# Altium project 031810516xcc.PrjPcb
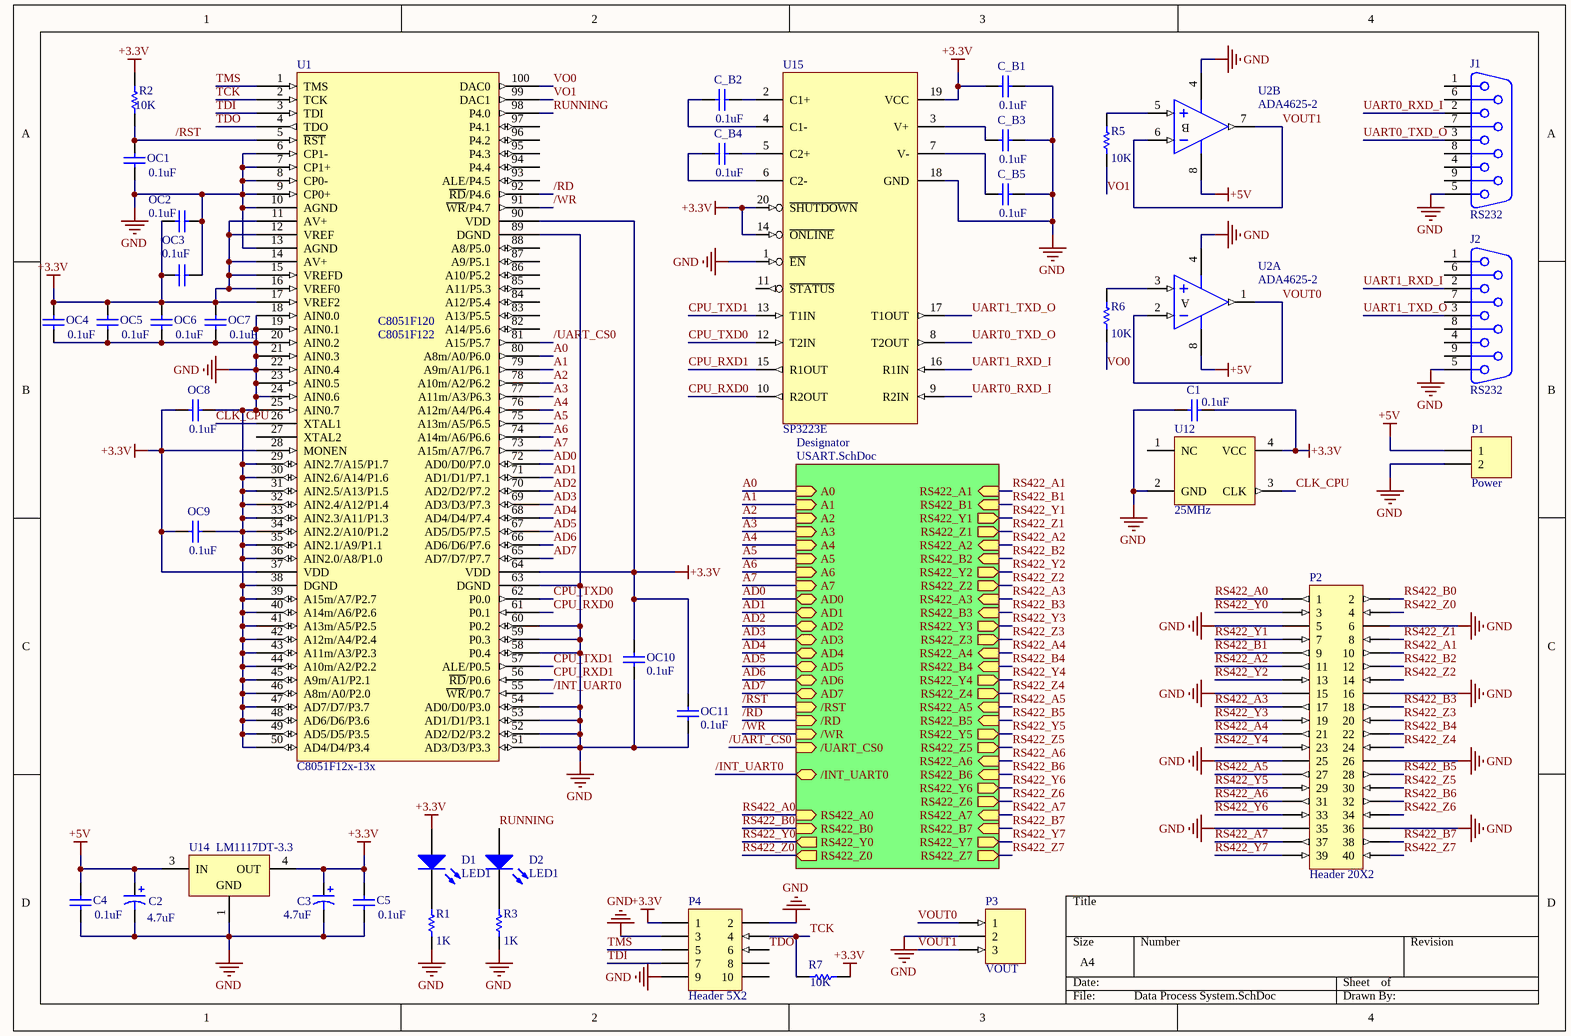
[diagram p0: Data Process System.SchDoc]
2 sheets, 65 parts. Net scope: hierarchical (ports join the sheet entries above them; power ports are global).
Board file: MyPCB.PcbDoc
Sheets:
  Data Process System.SchDoc
    Designator = USART.SchDoc

## Sheet Data Process System.SchDoc
size A4

### Parts
C1  value 0.1uF  [0805]  (hidden comment: Cap 0.1uf)
C2  value 4.7uF  [3528]  (hidden comment: Cap Pol 4.7uf)
C3  value 4.7uF  [3528]  (hidden comment: Cap Pol 4.7uf)
C4  value 0.1uF  [0805]  (hidden comment: Cap 0.1uf)
C5  value 0.1uF  [0805]  (hidden comment: Cap 0.1uf)
C_B1  value 0.1uF  [0805]  (hidden comment: Cap 0.1uf)
C_B2  value 0.1uF  [0805]  (hidden comment: Cap 0.1uf)
C_B3  value 0.1uF  [0805]  (hidden comment: Cap 0.1uf)
C_B4  value 0.1uF  [0805]  (hidden comment: Cap 0.1uf)
C_B5  value 0.1uF  [0805]  (hidden comment: Cap 0.1uf)
D1  LED1  [3216]
D2  LED1  [3216]
J1  RS232  [DSUB1.385-2H9]
J2  RS232  [DSUB1.385-2H9]
OC1  value 0.1uF  [0805]  (hidden comment: Cap 0.1uf)
OC2  value 0.1uF  [0805]  (hidden comment: Cap 0.1uf)
OC3  value 0.1uF  [0805]  (hidden comment: Cap 0.1uf)
OC4  value 0.1uF  [0805]  (hidden comment: Cap 0.1uf)
OC5  value 0.1uF  [0805]  (hidden comment: Cap 0.1uf)
OC6  value 0.1uF  [0805]  (hidden comment: Cap 0.1uf)
OC7  value 0.1uF  [0805]  (hidden comment: Cap 0.1uf)
OC8  value 0.1uF  [0805]  (hidden comment: Cap 0.1uf)
OC9  value 0.1uF  [0805]  (hidden comment: Cap 0.1uf)
OC10  value 0.1uF  [0805]  (hidden comment: Cap 0.1uf)
OC11  value 0.1uF  [0805]  (hidden comment: Cap 0.1uf)
P1  Power  [HDR1X2]
P2  Header 20X2  [HDR2X20]
P3  VOUT  [HDR1X3]
P4  Header 5X2  [HDR2X5]
R1  1k  [0805]
R2  10k  [0805]
R3  1k  [0805]
R5  10k  [0805]
R6  10k  [0805]
R7  10k  [0805]
U1  C8051F12x-13x  [TSQFP50P1600X1600X120-100N]
U2  ADA4625-2  [SO-8_L]  (parts A,B of 2)
U12  25MHz  [my_SiT8103]
U14  LM1117DT-3.3  [TD03B_N]
U15  SP3223E  [SOP65P800X200-20N]

### Sub-sheets
Designator = USART.SchDoc: /UART_CS0 (in), /INT_UART0 (bidir), RS422_A0 (in), RS422_B0 (in), RS422_Y0 (out), RS422_Z0 (out), A0 (in), A1 (in), A2 (in), A3 (in), A4 (in), A5 (in), A6 (in), A7 (in), AD0 (bidir), AD1 (bidir), AD2 (bidir), AD3 (bidir), AD4 (bidir), AD5 (bidir), AD6 (bidir), AD7 (bidir), /RST (in), /RD (in), /WR (in), RS422_Y1 (out), RS422_Z1 (out), RS422_A2 (in), RS422_B2 (in), RS422_Y2 (out), RS422_Z2 (out), RS422_A3 (in), RS422_B3 (in), RS422_Y3 (out), RS422_Z3 (out), RS422_A4 (in), RS422_B4 (in), RS422_Y4 (out), RS422_Z4 (out), RS422_A5 (in), RS422_B5 (in), RS422_Y5 (out), RS422_Z5 (out), RS422_A6 (in), RS422_B6 (in), RS422_Y6 (out), RS422_Z6 (out), RS422_A7 (in), RS422_B7 (in), RS422_Y7 (out), RS422_Z7 (out), RS422_A1 (in), RS422_B1 (in)

### Nets
+3.3V: C1.1 C3.1 C5.2 C_B1.1 D1.1(A) OC2.1 OC3.1 OC4.2 OC5.2 OC6.2 OC7.2 OC8.1 OC9.1 OC10.2 OC11.2 P4.1 R2.2 R7.2 U1.11(AV+) U1.12(VREF) U1.14(AV+) U1.15(VREFD) U1.16(VREF0) U1.17(VREF2) U1.28(MONEN) U1.37(VDD) U1.64(VDD) U1.90(VDD) U12.4(VCC) U14.4(OUT) U15.14(~{ONLINE}) U15.19(VCC) U15.20(~{SHUTDOWN})
+5V: C2.1 C4.2 P1.1 U2.8(V+) U14.3(IN)
GND: C1.2 C2.2 C3.2 C4.1 C5.1 C_B1.2 C_B3.2 C_B5.2 J1.5 J2.5 OC1.1 OC2.2 OC3.2 OC4.1 OC5.1 OC6.1 OC7.1 OC8.2 OC9.2 OC10.1 OC11.1 P1.2 P2.5 P2.6 P2.15 P2.16 P2.25 P2.26 P2.35 P2.36 P3.2 P4.2 P4.3 P4.9 R1.1 R3.1 U1.6(CP1-) U1.7(CP1+) U1.8(CP0-) U1.9(CP0+) U1.10(AGND) U1.13(AGND) U1.18(AIN0.0) U1.19(AIN0.1) U1.20(AIN0.2) U1.21(AIN0.3) U1.22(AIN0.4) U1.23(AIN0.5) U1.24(AIN0.6) U1.25(AIN0.7) U1.29(AIN2.7/A15/P1.7) U1.30(AIN2.6/A14/P1.6) U1.31(AIN2.5/A13/P1.5) U1.32(AIN2.4/A12/P1.4) U1.33(AIN2.3/A11/P1.3) U1.34(AIN2.2/A10/P1.2) U1.35(AIN2.1/A9/P1.1) U1.36(AIN2.0/A8/P1.0) U1.38(DGND) U1.39(A15m/A7/P2.7) U1.40(A14m/A6/P2.6) U1.41(A13m/A5/P2.5) U1.42(A12m/A4/P2.4) U1.43(A11m/A3/P2.3) U1.44(A10m/A2/P2.2) U1.45(A9m/A1/P2.1) U1.46(A8m/A0/P2.0) U1.47(AD7/D7/P3.7) U1.48(AD6/D6/P3.6) U1.49(AD5/D5/P3.5) U1.50(AD4/D4/P3.4) U1.51(AD3/D3/P3.3) U1.52(AD2/D2/P3.2) U1.53(AD1/D1/P3.1) U1.54(AD0/D0/P3.0) U1.58(P0.4) U1.59(P0.3) U1.60(P0.2) U1.63(DGND) U1.89(DGND) U2.4(V-) U12.2(GND) U14.1(GND) U15.1(~{EN}) U15.18(GND)
/INT_UART0: U1.55(~{WR}/P0.7) ; sheet Designator//INT_UART0
/RD: U1.92(~{RD}/P4.6) ; sheet Designator//RD
/RST: OC1.2 R2.1 U1.5(~{RST}) ; sheet Designator//RST
/UART_CS0: U1.81(A15/P5.7) ; sheet Designator//UART_CS0
/WR: U1.91(~{WR}/P4.7) ; sheet Designator//WR
A0: U1.80(A8m/A0/P6.0) ; sheet Designator/A0
A1: U1.79(A9m/A1/P6.1) ; sheet Designator/A1
A2: U1.78(A10m/A2/P6.2) ; sheet Designator/A2
A3: U1.77(A11m/A3/P6.3) ; sheet Designator/A3
A4: U1.76(A12m/A4/P6.4) ; sheet Designator/A4
A5: U1.75(A13m/A5/P6.5) ; sheet Designator/A5
A6: U1.74(A14m/A6/P6.6) ; sheet Designator/A6
A7: U1.73(A15m/A7/P6.7) ; sheet Designator/A7
AD0: U1.72(AD0/D0/P7.0) ; sheet Designator/AD0
AD1: U1.71(AD1/D1/P7.1) ; sheet Designator/AD1
AD2: U1.70(AD2/D2/P7.2) ; sheet Designator/AD2
AD3: U1.69(AD3/D3/P7.3) ; sheet Designator/AD3
AD4: U1.68(AD4/D4/P7.4) ; sheet Designator/AD4
AD5: U1.67(AD5/D5/P7.5) ; sheet Designator/AD5
AD6: U1.66(AD6/D6/P7.6) ; sheet Designator/AD6
AD7: U1.65(AD7/D7/P7.7) ; sheet Designator/AD7
CLK_CPU: U1.26(XTAL1) U12.3(CLK)
CPU_RXD0: U1.61(P0.1) U15.10(R2OUT)
CPU_RXD1: U1.56(~{RD}/P0.6) U15.15(R1OUT)
CPU_TXD0: U1.62(P0.0) U15.12(T2IN)
CPU_TXD1: U1.57(ALE/P0.5) U15.13(T1IN)
RS422_A0: P2.1 ; sheet Designator/RS422_A0
RS422_A1: P2.10 ; sheet Designator/RS422_A1
RS422_A2: P2.11 ; sheet Designator/RS422_A2
RS422_A3: P2.17 ; sheet Designator/RS422_A3
RS422_A4: P2.21 ; sheet Designator/RS422_A4
RS422_A5: P2.27 ; sheet Designator/RS422_A5
RS422_A6: P2.31 ; sheet Designator/RS422_A6
RS422_A7: P2.37 ; sheet Designator/RS422_A7
RS422_B0: P2.2 ; sheet Designator/RS422_B0
RS422_B1: P2.9 ; sheet Designator/RS422_B1
RS422_B2: P2.12 ; sheet Designator/RS422_B2
RS422_B3: P2.18 ; sheet Designator/RS422_B3
RS422_B4: P2.22 ; sheet Designator/RS422_B4
RS422_B5: P2.28 ; sheet Designator/RS422_B5
RS422_B6: P2.32 ; sheet Designator/RS422_B6
RS422_B7: P2.38 ; sheet Designator/RS422_B7
RS422_Y0: P2.3 ; sheet Designator/RS422_Y0
RS422_Y1: P2.7 ; sheet Designator/RS422_Y1
RS422_Y2: P2.13 ; sheet Designator/RS422_Y2
RS422_Y3: P2.19 ; sheet Designator/RS422_Y3
RS422_Y4: P2.23 ; sheet Designator/RS422_Y4
RS422_Y5: P2.29 ; sheet Designator/RS422_Y5
RS422_Y6: P2.33 ; sheet Designator/RS422_Y6
RS422_Y7: P2.39 ; sheet Designator/RS422_Y7
RS422_Z0: P2.4 ; sheet Designator/RS422_Z0
RS422_Z1: P2.8 ; sheet Designator/RS422_Z1
RS422_Z2: P2.14 ; sheet Designator/RS422_Z2
RS422_Z3: P2.20 ; sheet Designator/RS422_Z3
RS422_Z4: P2.24 ; sheet Designator/RS422_Z4
RS422_Z5: P2.30 ; sheet Designator/RS422_Z5
RS422_Z6: P2.34 ; sheet Designator/RS422_Z6
RS422_Z7: P2.40 ; sheet Designator/RS422_Z7
RUNNING: D2.1(A) U1.98(P4.0)
TCK: P4.4 R7.1 U1.2(TCK)
TDI: P4.7 U1.3(TDI)
TDO: P4.6 U1.4(TDO)
TMS: P4.5 U1.1(TMS)
UART0_RXD_I: J1.2 U15.9(R2IN)
UART0_TXD_O: J1.3 U15.8(T2OUT)
UART1_RXD_I: J2.2 U15.16(R1IN)
UART1_TXD_O: J2.3 U15.17(T1OUT)
VO0: R6.2 U1.100(DAC0)
VO1: R5.2 U1.99(DAC1)
VOUT0: P3.1 U2.1(OUT) U2.2(IN-)
VOUT1: P3.3 U2.6(IN-) U2.7(OUT)
NetC_B2_1: C_B2.1 U15.4(C1-)
NetC_B2_2: C_B2.2 U15.2(C1+)
NetC_B3_1: C_B3.1 U15.3(V+)
NetC_B4_1: C_B4.1 U15.6(C2-)
NetC_B4_2: C_B4.2 U15.5(C2+)
NetC_B5_1: C_B5.1 U15.7(V-)
NetD1_2: D1.2(K) R1.2
NetD2_2: D2.2(K) R3.2
NetR5_1: R5.1 U2.5(IN+)
NetR6_1: R6.1 U2.3(IN+)

Not connected (* = marked no-connect by the designer): J1 1 4 6 7 8 9; J2 1 4 6 7 8 9; P4 8 10; U1 27(XTAL2) 82(A14/P5.6) 83(A13/P5.5) 84(A12/P5.4) 85(A11/P5.3) 86(A10/P5.2) 87(A9/P5.1) 88(A8/P5.0) 93(ALE/P4.5) 94(P4.4) 95(P4.3) 96(P4.2) 97(P4.1); U12 1(NC); U15 11(~{STATUS})

### Notes on the sheet
- (in symbol COMPONENT_1) C8051F120; C8051F122
- (in symbol OP297GS, part A) A
- (in symbol OP297GS, part B) B

### Library data of the parts
C1 C4 C5 C_B1-C_B5 OC1-OC11 = Cap: Capacitor; Published: 8-Jun-2000; LatestRevisionDate: 17-Jul-2002; LatestRevisionNote: Re-released for DXP Platform.; PackageReference: RAD-0.3; Publisher: Altium Limited; PackageDescription: Radial Cap, Thru-Hole; 2 Leads; 0.3 in Pin Spacing
C2 C3 = Cap Pol3: Polarized Capacitor (Surface Mount); Published: 8-Jun-2000; LatestRevisionDate: 29-May-2009; LatestRevisionNote: IPC-7351 Footprint Added.; PackageReference: C0805; Publisher: Altium Limited; PackageDescription: Chip Capacitor
D1 D2 = LED1: Typical RED GaAs LED; Published: 8-Jun-2000; LatestRevisionDate: 08-Jul-2005; LatestRevisionNote: Mech Layer 1 removed.; PackageReference: LED-1; Publisher: Altium Limited; PackageDescription: LED; 2 Leads
J1 J2 = D Connector 9: Receptacle Assembly, 9 Position, Right Angle; PackageDocument: O; Positions: 9; Published: 15-Jun-2001; LatestRevisionDate: 17-Jul-2002; LatestRevisionNote: Re-released for DXP Platform.; DatasheetDocument: 1-Sep-1999; PackageReference: 788750; Publisher: Altium Limited; Orientation: Right Angle; Gender: Receptacle
P1 = Header 2: Header, 2-Pin; LatestRevisionDate: 17-Jul-2002; LatestRevisionNote: Re-released for DXP Platform.; Publisher: Altium Limited
P2 = Header 20X2: Header, 20-Pin, Dual row; LatestRevisionDate: 17-Jul-2002; LatestRevisionNote: Re-released for DXP Platform.; Publisher: Altium Limited
P3 = Header 3: Header, 3-Pin; LatestRevisionDate: 17-Jul-2002; LatestRevisionNote: Re-released for DXP Platform.; Publisher: Altium Limited
P4 = Header 5X2: Header, 5-Pin, Dual row; LatestRevisionDate: 17-Jul-2002; LatestRevisionNote: Re-released for DXP Platform.; Publisher: Altium Limited
R1-R3 R5-R7 = Res1: Resistor; Published: 8-Jun-2000; LatestRevisionDate: 17-Jul-2002; LatestRevisionNote: Re-released for DXP Platform.; PackageReference: AXIAL-0.3; Publisher: Altium Limited; PackageDescription: Axial Device, Thru-Hole; 2 Leads; 0.3 in Pin Spacing
  R1 R3: Value: 1K
  R2 R5-R7: Value: 10K
U1 = COMPONENT_1
U2 = OP297GS: Dual Low-Bias-Current Precision Operational Amplifier; Published: 8-Jun-2000; LatestRevisionDate: 13-Apr-2006; LatestRevisionNote: IPC-7351 Footprint Added.; DatasheetVersion: REV. D 1997; PackageVersion: revA; PackageReference: SO-8; Publisher: Altium Limited; PackageDescription: 8-Pin Small Outline Integrated Circuit 1.27 mm Pitch; Code_JEDEC: MS-012-AA; Code_IPC: SOIC127P600-8; ComponentLink1Description: Manufacturer Link; ComponentLink1URL: http://www.analog.com/en/prod/0,,759_786_OP297%2C00.html; ComponentLink2Description: Datasheet; ComponentLink2URL: http://www.analog.com/UploadedFiles/Data_Sheets/36971711685OP297_e_.pdf; ComponentLink3Description: Discontinuation Notice; ComponentLink3URL: http://www.analog.com/UploadedFiles/Aerospace_Information/505817548385948813507767505obsolete.pdf
U12 = my_SiT8103
U14 = LM1117DT-3.3: 800mA Low-Dropout Linear Regulator, 3-pin TO-252; Manufacturer: National Semiconductor; PackageTopMarking: NSUZXYTT*LM1117*DT-3.3; PowerWise: N; CompType: LDO IC; Published: 4-Dec-2008; DatasheetVersion: Apr-2006; PackageVersion: revD, Feb-2009; PackageReference: TD03B; Publisher: Altium Limited; PackageDescription: TO252, Molded, Jedec, 6.8 x 6.10 x 2.30mm Body, 3 Lead, 2.28mm Pitch, Surface Mount; Supplier 1: Farnell; Supplier Part Number 1: 9486275; Supplier 2: Farnell; Supplier Part Number 2: 1523829; PartNumber: LM1117DT-3.3; RoHS: N; PinCount: 3; Code_JEDEC: TO-252-AA; ComponentLink1Description: LM1117 Datasheet; ComponentLink1URL: http://www.national.com/ds/LM/LM1117.pdf; ComponentLink2Description: LM1117 Web Page; ComponentLink2URL: http://www.national.com/pf/LM/LM1117.html; ComponentLink3Description: TD03B Package Page; ComponentLink3URL: http://www.national.com/packaging/folders/td03b.html
U15 = my_SP3223E

## Sheet USART.SchDoc
size A4
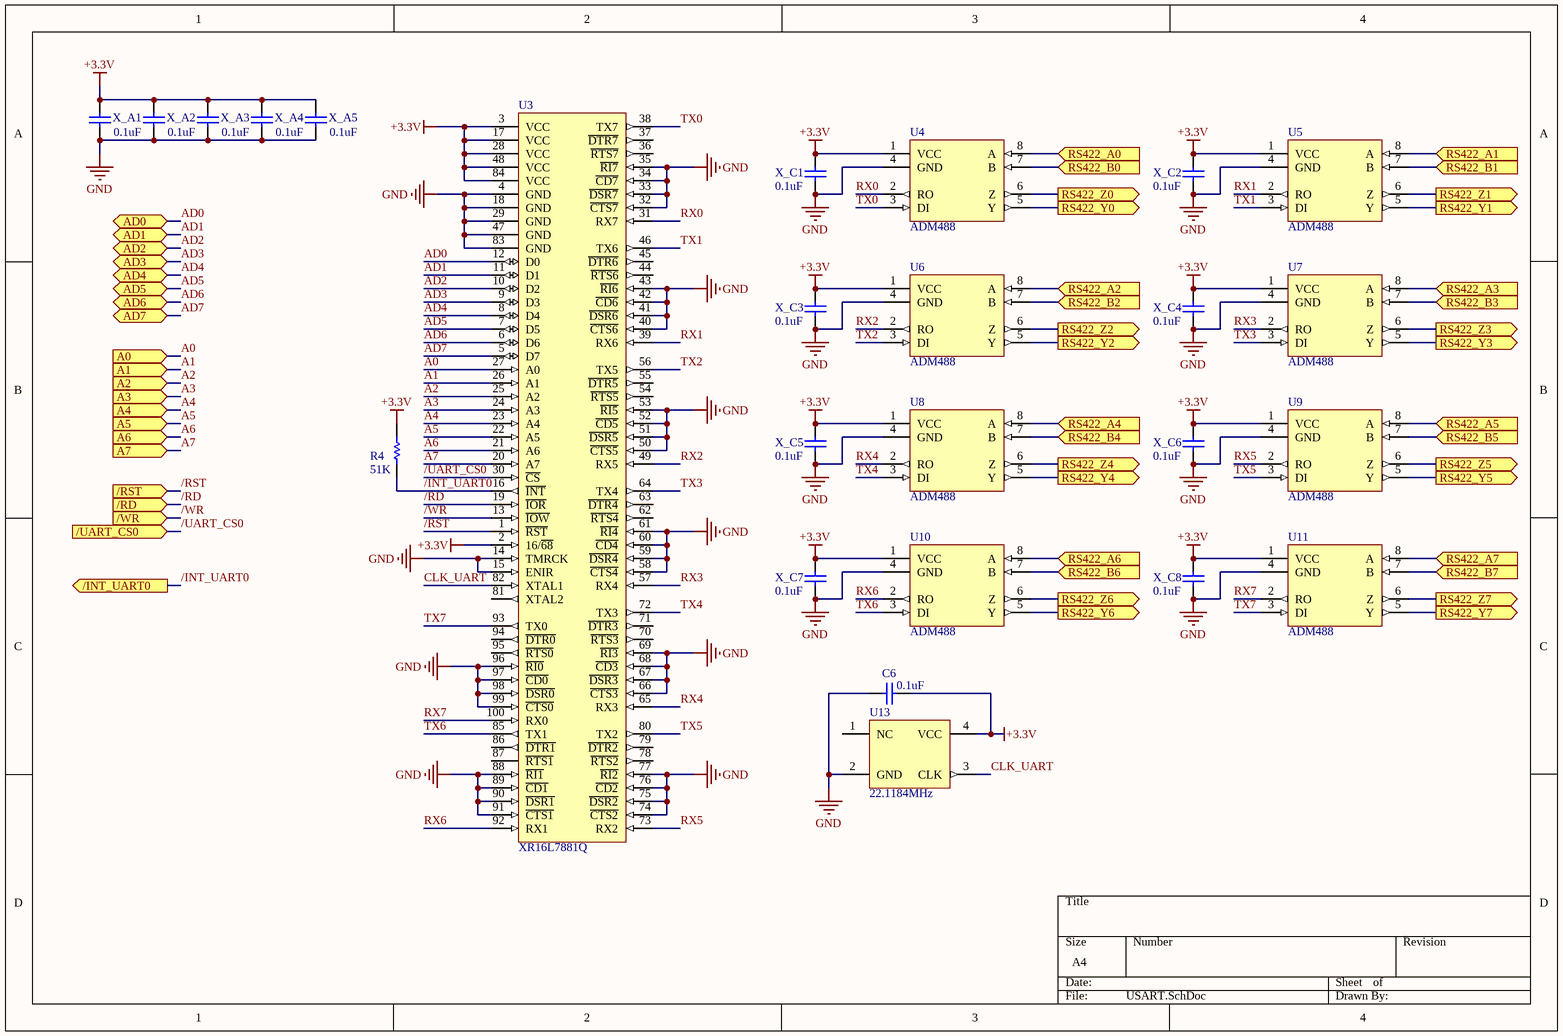
[diagram p1: USART.SchDoc]

### Parts
C6  value 0.1uF  [0805]  (hidden comment: Cap 0.1uf)
R4  51k  [0805]
U3  XR16L7881Q  [QFP65P1800X2400X300-100N_30*20]
U4  ADM488  [SO-8_L]
U5  ADM488  [SO-8_L]
U6  ADM488  [SO-8_L]
U7  ADM488  [SO-8_L]
U8  ADM488  [SO-8_L]
U9  ADM488  [SO-8_L]
U10  ADM488  [SO-8_L]
U11  ADM488  [SO-8_L]
U13  22.1184MHz  [my_SiT8103]
X_A1  value 0.1uF  [0805]  (hidden comment: Cap 0.1uf)
X_A2  value 0.1uF  [0805]  (hidden comment: Cap 0.1uf)
X_A3  value 0.1uF  [0805]  (hidden comment: Cap 0.1uf)
X_A4  value 0.1uF  [0805]  (hidden comment: Cap 0.1uf)
X_A5  value 0.1uF  [0805]  (hidden comment: Cap 0.1uf)
X_C1  value 0.1uF  [0805]  (hidden comment: Cap 0.1uf)
X_C2  value 0.1uF  [0805]  (hidden comment: Cap 0.1uf)
X_C3  value 0.1uF  [0805]  (hidden comment: Cap 0.1uf)
X_C4  value 0.1uF  [0805]  (hidden comment: Cap 0.1uf)
X_C5  value 0.1uF  [0805]  (hidden comment: Cap 0.1uf)
X_C6  value 0.1uF  [0805]  (hidden comment: Cap 0.1uf)
X_C7  value 0.1uF  [0805]  (hidden comment: Cap 0.1uf)
X_C8  value 0.1uF  [0805]  (hidden comment: Cap 0.1uf)

### Ports
/INT_UART0 (out), /RD (in), /RST (in), /UART_CS0 (in), /WR (in), A0 (in), A1 (in), A2 (in), A3 (in), A4 (in), A5 (in), A6 (in), A7 (in), AD0 (bidir), AD1 (bidir), AD2 (bidir), AD3 (bidir), AD4 (bidir), AD5 (bidir), AD6 (bidir), AD7 (bidir), RS422_A0 (in), RS422_A1 (in), RS422_A2 (in), RS422_A3 (in), RS422_A4 (in), RS422_A5 (in), RS422_A6 (in), RS422_A7 (in), RS422_B0 (in), RS422_B1 (in), RS422_B2 (in), RS422_B3 (in), RS422_B4 (in), RS422_B5 (in), RS422_B6 (in), RS422_B7 (in), RS422_Y0 (out), RS422_Y1 (out), RS422_Y2 (out), RS422_Y3 (out), RS422_Y4 (out), RS422_Y5 (out), RS422_Y6 (out), RS422_Y7 (out), RS422_Z0 (out), RS422_Z1 (out), RS422_Z2 (out), RS422_Z3 (out), RS422_Z4 (out), RS422_Z5 (out), RS422_Z6 (out), RS422_Z7 (out)

### Nets
+3.3V: C6.1 R4.2 U3.2(16/~{68}) U3.3(VCC) U3.17(VCC) U3.28(VCC) U3.48(VCC) U3.84(VCC) U4.1(VCC) U5.1(VCC) U6.1(VCC) U7.1(VCC) U8.1(VCC) U9.1(VCC) U10.1(VCC) U11.1(VCC) U13.4(VCC) X_A1.2 X_A2.2 X_A3.2 X_A4.2 X_A5.2 X_C1.2 X_C2.2 X_C3.2 X_C4.2 X_C5.2 X_C6.2 X_C7.2 X_C8.2
GND: C6.2 U3.4(GND) U3.14(TMRCK) U3.15(ENIR) U3.18(GND) U3.29(GND) U3.32(~{CTS7}) U3.33(~{DSR7}) U3.34(~{CD7}) U3.35(~{RI7}) U3.40(~{CTS6}) U3.41(~{DSR6}) U3.42(~{CD6}) U3.43(~{RI6}) U3.47(GND) U3.50(~{CTS5}) U3.51(~{DSR5}) U3.52(~{CD5}) U3.53(~{RI5}) U3.58(~{CTS4}) U3.59(~{DSR4}) U3.60(~{CD4}) U3.61(~{RI4}) U3.66(~{CTS3}) U3.67(~{DSR3}) U3.68(~{CD3}) U3.69(~{RI3}) U3.74(~{CTS2}) U3.75(~{DSR2}) U3.76(~{CD2}) U3.77(~{RI2}) U3.83(GND) U3.88(~{RI1}) U3.89(~{CD1}) U3.90(~{DSR1}) U3.91(~{CTS1}) U3.96(~{RI0}) U3.97(~{CD0}) U3.98(~{DSR0}) U3.99(~{CTS0}) U4.4(GND) U5.4(GND) U6.4(GND) U7.4(GND) U8.4(GND) U9.4(GND) U10.4(GND) U11.4(GND) U13.2(GND) X_A1.1 X_A2.1 X_A3.1 X_A4.1 X_A5.1 X_C1.1 X_C2.1 X_C3.1 X_C4.1 X_C5.1 X_C6.1 X_C7.1 X_C8.1
/INT_UART0: R4.1 U3.16(~{INT}) ; port /INT_UART0
/RD: U3.19(~{IOR}) ; port /RD
/RST: U3.1(~{RST}) ; port /RST
/UART_CS0: U3.30(~{CS}) ; port /UART_CS0
/WR: U3.13(~{IOW}) ; port /WR
A0: U3.27(A0) ; port A0
A1: U3.26(A1) ; port A1
A2: U3.25(A2) ; port A2
A3: U3.24(A3) ; port A3
A4: U3.23(A4) ; port A4
A5: U3.22(A5) ; port A5
A6: U3.21(A6) ; port A6
A7: U3.20(A7) ; port A7
AD0: U3.12(D0) ; port AD0
AD1: U3.11(D1) ; port AD1
AD2: U3.10(D2) ; port AD2
AD3: U3.9(D3) ; port AD3
AD4: U3.8(D4) ; port AD4
AD5: U3.7(D5) ; port AD5
AD6: U3.6(D6) ; port AD6
AD7: U3.5(D7) ; port AD7
CLK_UART: U3.82(XTAL1) U13.3(CLK)
RS422_A0: U4.8(A) ; port RS422_A0
RS422_A1: U5.8(A) ; port RS422_A1
RS422_A2: U6.8(A) ; port RS422_A2
RS422_A3: U7.8(A) ; port RS422_A3
RS422_A4: U8.8(A) ; port RS422_A4
RS422_A5: U9.8(A) ; port RS422_A5
RS422_A6: U10.8(A) ; port RS422_A6
RS422_A7: U11.8(A) ; port RS422_A7
RS422_B0: U4.7(B) ; port RS422_B0
RS422_B1: U5.7(B) ; port RS422_B1
RS422_B2: U6.7(B) ; port RS422_B2
RS422_B3: U7.7(B) ; port RS422_B3
RS422_B4: U8.7(B) ; port RS422_B4
RS422_B5: U9.7(B) ; port RS422_B5
RS422_B6: U10.7(B) ; port RS422_B6
RS422_B7: U11.7(B) ; port RS422_B7
RS422_Y0: U4.5(Y) ; port RS422_Y0
RS422_Y1: U5.5(Y) ; port RS422_Y1
RS422_Y2: U6.5(Y) ; port RS422_Y2
RS422_Y3: U7.5(Y) ; port RS422_Y3
RS422_Y4: U8.5(Y) ; port RS422_Y4
RS422_Y5: U9.5(Y) ; port RS422_Y5
RS422_Y6: U10.5(Y) ; port RS422_Y6
RS422_Y7: U11.5(Y) ; port RS422_Y7
RS422_Z0: U4.6(Z) ; port RS422_Z0
RS422_Z1: U5.6(Z) ; port RS422_Z1
RS422_Z2: U6.6(Z) ; port RS422_Z2
RS422_Z3: U7.6(Z) ; port RS422_Z3
RS422_Z4: U8.6(Z) ; port RS422_Z4
RS422_Z5: U9.6(Z) ; port RS422_Z5
RS422_Z6: U10.6(Z) ; port RS422_Z6
RS422_Z7: U11.6(Z) ; port RS422_Z7
RX0: U3.31(RX7) U4.2(RO)
RX1: U3.39(RX6) U5.2(RO)
RX2: U3.49(RX5) U6.2(RO)
RX3: U3.57(RX4) U7.2(RO)
RX4: U3.65(RX3) U8.2(RO)
RX5: U3.73(RX2) U9.2(RO)
RX6: U3.92(RX1) U10.2(RO)
RX7: U3.100(RX0) U11.2(RO)
TX0: U3.38(TX7) U4.3(DI)
TX1: U3.46(TX6) U5.3(DI)
TX2: U3.56(TX5) U6.3(DI)
TX3: U3.64(TX4) U7.3(DI)
TX4: U3.72(TX3) U8.3(DI)
TX5: U3.80(TX2) U9.3(DI)
TX6: U3.85(TX1) U10.3(DI)
TX7: U3.93(TX0) U11.3(DI)

Not connected (* = marked no-connect by the designer): U3 36(~{RTS7}) 37(~{DTR7}) 44(~{RTS6}) 45(~{DTR6}) 54(~{RTS5}) 55(~{DTR5}) 62(~{RTS4}) 63(~{DTR4}) 70(~{RTS3}) 71(~{DTR3}) 78(~{RTS2}) 79(~{DTR2}) 81(XTAL2) 86(~{DTR1}) 87(~{RTS1}) 94(~{DTR0}) 95(~{RTS0}); U13 1(NC)

### Library data of the parts
C6 X_A1-X_A5 X_C1-X_C8 = Cap: Capacitor; Published: 8-Jun-2000; LatestRevisionDate: 17-Jul-2002; LatestRevisionNote: Re-released for DXP Platform.; PackageReference: RAD-0.3; Publisher: Altium Limited; PackageDescription: Radial Cap, Thru-Hole; 2 Leads; 0.3 in Pin Spacing
R4 = Res1: Resistor; Published: 8-Jun-2000; LatestRevisionDate: 17-Jul-2002; LatestRevisionNote: Re-released for DXP Platform.; PackageReference: AXIAL-0.3; Publisher: Altium Limited; PackageDescription: Axial Device, Thru-Hole; 2 Leads; 0.3 in Pin Spacing; Value: 51K
U3 = my_XR16L7881Q
U4-U11 = my_ADM488
U13 = my_SiT8103

## Nets that join several sheets
+3.3V: Data Process System (33 pins), USART (30 pins)
GND: Data Process System (85 pins), USART (62 pins)
/INT_UART0: Data Process System (U1.55), USART (R4.1 U3.16)
/RD: Data Process System (U1.92), USART (U3.19)
/RST: Data Process System (OC1.2 R2.1 U1.5), USART (U3.1)
/UART_CS0: Data Process System (U1.81), USART (U3.30)
/WR: Data Process System (U1.91), USART (U3.13)
A0: Data Process System (U1.80), USART (U3.27)
A1: Data Process System (U1.79), USART (U3.26)
A2: Data Process System (U1.78), USART (U3.25)
A3: Data Process System (U1.77), USART (U3.24)
A4: Data Process System (U1.76), USART (U3.23)
A5: Data Process System (U1.75), USART (U3.22)
A6: Data Process System (U1.74), USART (U3.21)
A7: Data Process System (U1.73), USART (U3.20)
AD0: Data Process System (U1.72), USART (U3.12)
AD1: Data Process System (U1.71), USART (U3.11)
AD2: Data Process System (U1.70), USART (U3.10)
AD3: Data Process System (U1.69), USART (U3.9)
AD4: Data Process System (U1.68), USART (U3.8)
AD5: Data Process System (U1.67), USART (U3.7)
AD6: Data Process System (U1.66), USART (U3.6)
AD7: Data Process System (U1.65), USART (U3.5)
RS422_A0: Data Process System (P2.1), USART (U4.8)
RS422_A1: Data Process System (P2.10), USART (U5.8)
RS422_A2: Data Process System (P2.11), USART (U6.8)
RS422_A3: Data Process System (P2.17), USART (U7.8)
RS422_A4: Data Process System (P2.21), USART (U8.8)
RS422_A5: Data Process System (P2.27), USART (U9.8)
RS422_A6: Data Process System (P2.31), USART (U10.8)
RS422_A7: Data Process System (P2.37), USART (U11.8)
RS422_B0: Data Process System (P2.2), USART (U4.7)
RS422_B1: Data Process System (P2.9), USART (U5.7)
RS422_B2: Data Process System (P2.12), USART (U6.7)
RS422_B3: Data Process System (P2.18), USART (U7.7)
RS422_B4: Data Process System (P2.22), USART (U8.7)
RS422_B5: Data Process System (P2.28), USART (U9.7)
RS422_B6: Data Process System (P2.32), USART (U10.7)
RS422_B7: Data Process System (P2.38), USART (U11.7)
RS422_Y0: Data Process System (P2.3), USART (U4.5)
RS422_Y1: Data Process System (P2.7), USART (U5.5)
RS422_Y2: Data Process System (P2.13), USART (U6.5)
RS422_Y3: Data Process System (P2.19), USART (U7.5)
RS422_Y4: Data Process System (P2.23), USART (U8.5)
RS422_Y5: Data Process System (P2.29), USART (U9.5)
RS422_Y6: Data Process System (P2.33), USART (U10.5)
RS422_Y7: Data Process System (P2.39), USART (U11.5)
RS422_Z0: Data Process System (P2.4), USART (U4.6)
RS422_Z1: Data Process System (P2.8), USART (U5.6)
RS422_Z2: Data Process System (P2.14), USART (U6.6)
RS422_Z3: Data Process System (P2.20), USART (U7.6)
RS422_Z4: Data Process System (P2.24), USART (U8.6)
RS422_Z5: Data Process System (P2.30), USART (U9.6)
RS422_Z6: Data Process System (P2.34), USART (U10.6)
RS422_Z7: Data Process System (P2.40), USART (U11.6)